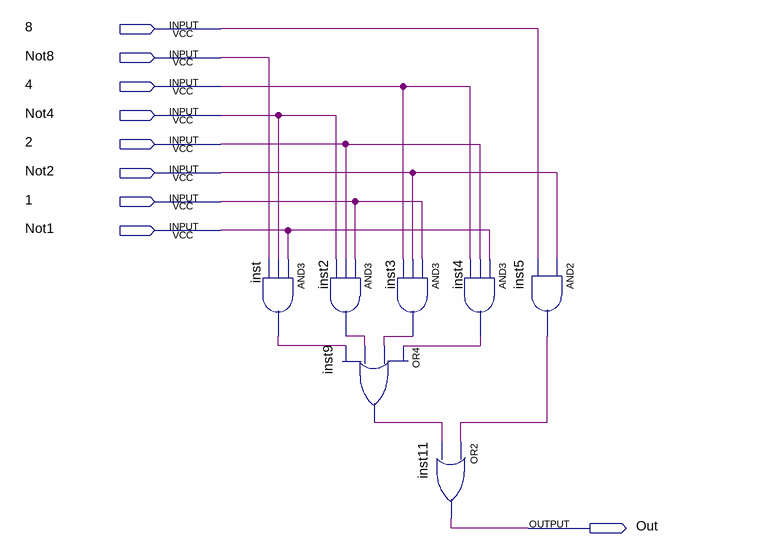
[diagram p0: schematic sheet]
// Quartus schematic D.bdf as structural Verilog: 7 symbols, 9 pins
module D (
  input  \8 ,
  input  Not8,
  input  \4 ,
  input  Not4,
  input  \2 ,
  input  Not2,
  input  \1 ,
  input  Not1,
  output Out
);

  wire inst2_out, inst3_out, inst4_out, inst5_out, inst9_out, inst_out;

  and inst (inst_out, Not1, Not4, Not8);
  and inst2 (inst2_out, \1 , \2 , Not4);
  and inst3 (inst3_out, \1 , Not2, \4 );
  or inst9 (inst9_out, inst4_out, inst3_out, inst2_out, inst_out);
  and inst4 (inst4_out, Not1, \2 , \4 );
  or inst11 (Out, inst5_out, inst9_out);
  and inst5 (inst5_out, Not2, \8 );
endmodule
